# Altium project Ticket_Dispancer.PrjPcb (part 2 of 3)

## Sheet LAN.SchDoc
size A4; SheetNumber: 4; SheetTotal: 8
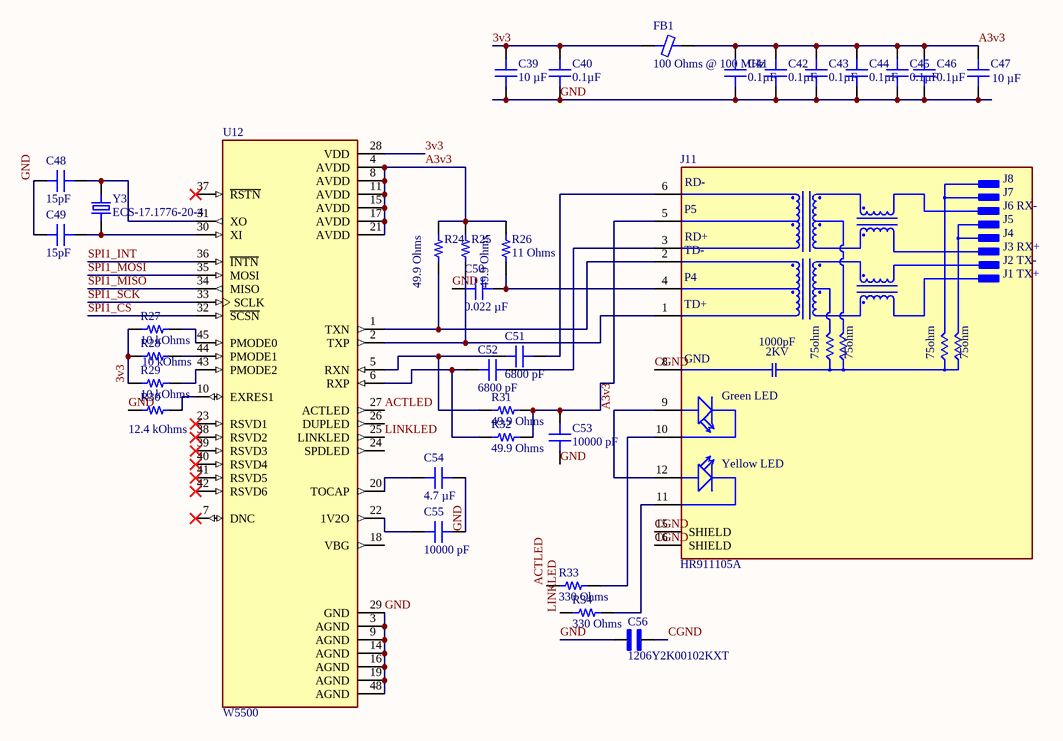
[diagram p3: LAN.SchDoc]

### Parts
C39  10 µF  [CAP 1206_3216 - 0.8MM]
C40  Capacitance: 0.1µF  [CAP 0805_2012]  (hidden comment: 1µF)
C41  Capacitance: 0.1µF  [CAP 0805_2012]  (hidden comment: 1µF)
C42  Capacitance: 0.1µF  [CAP 0805_2012]  (hidden comment: 1µF)
C43  Capacitance: 0.1µF  [CAP 0805_2012]  (hidden comment: 1µF)
C44  Capacitance: 0.1µF  [CAP 0805_2012]  (hidden comment: 1µF)
C45  Capacitance: 0.1µF  [CAP 0805_2012]  (hidden comment: 1µF)
C46  Capacitance: 0.1µF  [CAP 0805_2012]  (hidden comment: 1µF)
C47  10 µF  [CAP 1206_3216 - 0.8MM]
C48  15pF  [CAP 0805_2012]
C49  15pF  [CAP 0805_2012]
C50  0.022 µF  [CAP 0805_2012]
C51  6800 pF  [CAP 0805_2012]
C52  6800 pF  [CAP 0805_2012]
C53  10000 pF  [CAP 0805_2012]
C54  4.7 µF  [CAP 0805_2012]
C55  10000 pF  [CAP 0805_2012]
C56  1206Y2K00102KXT  [CAPC3216X160N]
FB1  100 Ohms @ 100 MHz  [FER 0805_2012]
J11  HR911105A  [HANRUN_HR911105A]
R24  49.9 Ohms  [RES 0805_2012]
R25  49.9 Ohms  [RES 0805_2012]
R26  11 Ohms  [RES 0805_2012]
R27  10 kOhms  [RES 0805_2012]
R28  10 kOhms  [RES 0805_2012]
R29  10 kOhms  [RES 0805_2012]
R30  12.4 kOhms  [RES 0805_2012]
R31  49.9 Ohms  [RES 0805_2012]
R32  49.9 Ohms  [RES 0805_2012]
R33  330 Ohms  [YAGEO RES 0805_2012]
R34  330 Ohms  [YAGEO RES 0805_2012]
U12  W5500  [QFP50P900X900X160-48N]
Y3  ECS-17.1776-20-4  [XTAL_ECS-160-20-4X]

### Nets
3v3: C39.2 C40.2 FB1.1 R27.1 R28.1 R29.1 U12.28(VDD)
A3v3: C41.2 C42.2 C43.2 C44.2 C45.2 C46.2 C47.2 FB1.2 J11.9(GA) J11.12(YA) R24.2 R25.2 R26.2 U12.4(AVDD) U12.8(AVDD) U12.11(AVDD) U12.15(AVDD) U12.17(AVDD) U12.21(AVDD)
ACTLED: R33.1 U12.27(ACTLED)
CGND: C56.2 J11.8(GND) J11.15(SHIELD) J11.16(SHIELD)
GND: C39.1 C40.1 C41.1 C42.1 C43.1 C44.1 C45.1 C46.1 C47.1 C48.1 C49.1 C50.2 C53.1 C54.2 C55.2 C56.1 R30.1 U12.3(AGND) U12.9(AGND) U12.14(AGND) U12.16(AGND) U12.19(AGND) U12.29(GND) U12.48(AGND)
LINKLED: R34.1 U12.25(LINKLED)
SPI1_CS: U12.32(~{SCSN})
SPI1_INT: U12.36(~{INTN})
SPI1_MISO: U12.34(MISO)
SPI1_MOSI: U12.35(MOSI)
SPI1_SCK: U12.33(SCLK)
NetC48_2: C48.2 U12.31(XO) Y3.2
NetC49_2: C49.2 U12.30(XI) Y3.1
NetC50_1: C50.1 J11.4(P4) R26.1
NetC51_1: C51.1 R31.2 U12.5(RXN)
NetC51_2: C51.2 J11.6(RD-)
NetC52_1: C52.1 R32.2 U12.6(RXP)
NetC52_2: C52.2 J11.3(RD+)
NetC53_2: C53.2 J11.5(P5) R31.1 R32.1
NetC54_1: C54.1 U12.20(TOCAP)
NetC55_1: C55.1 U12.22(1V2O)
NetJ11_1: J11.1(TD+) R25.1 U12.2(TXP)
NetJ11_2: J11.2(TD-) R24.1 U12.1(TXN)
NetJ11_10: J11.10(GC) R33.2
NetJ11_11: J11.11(YC) R34.2
NetR27_2: R27.2 U12.45(PMODE0)
NetR28_2: R28.2 U12.44(PMODE1)
NetR29_2: R29.2 U12.43(PMODE2)
NetR30_2: R30.2 U12.10(EXRES1)

Not connected (* = marked no-connect by the designer): U12 7(DNC)* 18(VBG) 23(RSVD1)* 24(SPDLED) 26(DUPLED) 37(~{RSTN})* 38(RSVD2)* 39(RSVD3)* 40(RSVD4)* 41(RSVD5)* 42(RSVD6)*

### Notes on the sheet
- (in symbol HR911105A) J8; J7; J6 RX-; J5; J4; J3 RX+; J2 TX-; J1 TX+; 1000pF; 2KV; 75ohm; Green LED; Yellow LED

### Library data of the parts
C39 C47 = EMK316BJ106MD-T: CAP CER 10UF 16V X5R 1206; manufacturer: Taiyo Yuden; Tolerance: ±20%; Part Number: EMK316BJ106MD-T; Capacitance: 10 µF; Applications: SMPS Filtering; componentlink1description: Datasheet; componentlink1url: http://www.yuden.co.jp/productdata/catalog/mlcc06_e.pdf; componentlink2description: DigiKey Link; componentlink2url: https://www.digikey.com/en/products/detail/taiyo-yuden/EMK316BJ106MD-T/6563474; Device Package: 1206 (3216 Metric); lastupdated: 04-06-2024 7.10.41 PM; Lifecycle Status: Active; Minimum Order: 1; Mounting Type: Surface Mount, MLCC; Operating Temperature: -55°C ~ 85°C; Package / Case: 1206 (3216 Metric); packaging: TapeAndReel; partid: 18996; Part Status: Active; price: 0.04; series: M; Size / Dimension: 0.126" L x 0.063" W (3.20mm x 1.60mm); Supplier 1: DigiKey; Supplier Part Number 1: 587-4881-1-ND; Temperature Coefficient: X5R; Thickness (Max): 0.037" (0.95mm); value: 10 µF; Voltage - Rated: 16V
C40-C46 = 0805ZC105KAT4A: CAP CER 1UF 10V X7R 0805; manufacturer: AVX Corporation; Tolerance: ±10%; Part Number: 0805ZC105KAT4A; Applications: General Purpose; componentlink1description: Datasheet; componentlink1url: http://datasheets.avx.com/X7RDielectric.pdf; componentlink2description: DigiKey Link; componentlink2url: http://digikey.com/product-detail/en/avx-corporation/0805ZC105KAT4A/478-7604-1-ND/7536237; Device Package: 0805 (2012 Metric); lastupdated: 02-09-2020 1.04.40 AM; Lifecycle Status: Active; Minimum Order: 1; Mounting Type: Surface Mount, MLCC; Operating Temperature: -55°C ~ 125°C; Package / Case: 0805 (2012 Metric); packaging: TapeAndReel; partid: 3500; Part Status: Active; price: 0.17; series: -; Size / Dimension: 0.079" L x 0.049" W (2.00mm x 1.25mm); Supplier 1: DigiKey; Supplier Part Number 1: 478-7604-1-ND; Temperature Coefficient: X7R; Thickness (Max): 0.037" (0.94mm); value: 1µF; Voltage - Rated: 10V
C48 C49 = 08055A150JAT2A: CAP CER 15PF 50V C0G/NP0 0805; manufacturer: AVX Corporation; Temperature Coefficient: C0G, NP0; Tolerance: ±5%; Part Number: 08055A150JAT2A; Capacitance: 15pF; Applications: General Purpose; componentlink1description: Datasheet; componentlink1url: http://datasheets.avx.com/C0GNP0-Dielectric.pdf; componentlink2description: DigiKey Link; componentlink2url: http://digikey.com/product-detail/en/avx-corporation/08055A150JAT2A/478-1306-1-ND/564338; Device Package: 0805 (2012 Metric); lastupdated: 02-09-2020 1.04.40 AM; Lifecycle Status: Active; Minimum Order: 1; Mounting Type: Surface Mount, MLCC; Operating Temperature: -55°C ~ 125°C; Package / Case: 0805 (2012 Metric); packaging: TapeAndReel; partid: 3213; Part Status: Active; price: 0.02; series: -; Size / Dimension: 0.079" L x 0.049" W (2.01mm x 1.25mm); Supplier 1: DigiKey; Supplier Part Number 1: 478-1306-1-ND; Thickness (Max): 0.037" (0.94mm); value: 15pF; Voltage - Rated: 50V
C50 = C0805C223K5RECAUTO: CAP CER 0805 22NF 50V X7R 10%; manufacturer: KEMET; Part Number: C0805C223K5RECAUTO; Capacitance: 0.022 µF; Applications: Automotive, ESD Protection; componentlink1description: Datasheet; componentlink1url: https://api.kemet.com/component-edge/download/datasheet/C0805C223K5RECAUTO.pdf; componentlink2description: DigiKey Link; componentlink2url: https://www.digikey.com/en/products/detail/kemet/C0805C223K5RECAUTO/8640480; Device Package: 0805 (2012 Metric); lastupdated: 09-02-2024 8.15.30 PM; Lifecycle Status: Active; Minimum Order: 1; Mounting Type: Surface Mount, MLCC; Operating Temperature: -55°C ~ 125°C; Package / Case: 0805 (2012 Metric); packaging: TapeAndReel; partid: 15719; Part Status: Active; price: 0.04; Ratings: AEC-Q200; series: ESD SMD Auto X7R; Size / Dimension: 0.079" L x 0.049" W (2.00mm x 1.25mm); Supplier 1: DigiKey; Supplier Part Number 1: 399-17886-1-ND; Temperature Coefficient: X7R; Thickness (Max): 0.035" (0.88mm); Tolerance: ±10%; value: 0.022 µF; Voltage - Rated: 50V
C51 C52 = C0805C682M3GEC7800: CAP CER 0805 6.8NF 25V C0G 20%; manufacturer: KEMET; Temperature Coefficient: C0G, NP0; Part Number: C0805C682M3GEC7800; Capacitance: 6800 pF; Applications: ESD Protection; componentlink1description: Datasheet; componentlink1url: https://connect.kemet.com:7667/gateway/IntelliData-ComponentDocumentation/1.0/download/datasheet/C0805C682M3GEC7800; componentlink2description: DigiKey Link; componentlink2url: https://www.digikey.com/en/products/detail/kemet/C0805C682M3GEC7800/8644610; Device Package: 0805 (2012 Metric); Features: Low ESL; lastupdated: 09-02-2024 8.14.56 PM; Lifecycle Status: Active; Minimum Order: 1; Mounting Type: Surface Mount, MLCC; Operating Temperature: -55°C ~ 125°C; Package / Case: 0805 (2012 Metric); packaging: TapeAndReel; partid: 46454; Part Status: Active; price: 0.06; series: ESD SMD Comm C0G; Size / Dimension: 0.079" L x 0.049" W (2.00mm x 1.25mm); Supplier 1: DigiKey; Supplier Part Number 1: 399-C0805C682M3GEC7800CT-ND; Thickness (Max): 0.055" (1.40mm); Tolerance: ±20%; value: 6800 pF; Voltage - Rated: 25V
C53 C55 = C0805X103K1RAC3316: CAP CER 0805 10NF 100V X7R; manufacturer: KEMET; Tolerance: ±10%; Part Number: C0805X103K1RAC3316; Capacitance: 10000 pF; Applications: Automotive, Boardflex Sensitive; componentlink1description: Datasheet; componentlink1url: https://api.kemet.com/component-edge/download/datasheet/C0805X103K1RAC3316.pdf; componentlink2description: DigiKey Link; componentlink2url: https://www.digikey.com/en/products/detail/kemet/C0805X103K1RAC3316/10315780; Device Package: 0805 (2012 Metric); Features: Soft Termination; lastupdated: 09-02-2024 8.16.09 PM; Lifecycle Status: Active; Minimum Order: 1; Mounting Type: Surface Mount, MLCC; Operating Temperature: -55°C ~ 125°C; Package / Case: 0805 (2012 Metric); packaging: TapeAndReel; partid: 2565; Part Status: Active; price: 0.02; Ratings: AEC-Q200; series: SMD Auto X7R VW80808; Size / Dimension: 0.079" L x 0.049" W (2.00mm x 1.25mm); Supplier 1: DigiKey; Supplier Part Number 1: 399-C0805X103K1RAC3316CT-ND; Temperature Coefficient: X7R; Thickness (Max): 0.039" (0.98mm); value: 10000 pF; Voltage - Rated: 100V
C54 = C0805X475M3RAC7800: 4.70UF 25.0V; manufacturer: KEMET; Temperature Coefficient: X7R; Tolerance: ±20%; Voltage - Rated: 25V; Part Number: C0805X475M3RAC7800; Capacitance: 4.7 µF; Applications: Boardflex Sensitive; componentlink1description: Datasheet; componentlink1url: https://connect.kemet.com:7667/gateway/IntelliData-ComponentDocumentation/1.0/download/datasheet/C0805X475M3RAC7800; componentlink2description: DigiKey Link; componentlink2url: https://www.digikey.com/en/products/detail/kemet/C0805X475M3RAC7800/12082671; Device Package: 0805 (2012 Metric); Features: Soft Termination; lastupdated: 09-02-2024 8.14.56 PM; Lifecycle Status: Active; Minimum Order: 1; Mounting Type: Surface Mount, MLCC; Operating Temperature: -55°C ~ 125°C; Package / Case: 0805 (2012 Metric); packaging: TapeAndReel; partid: 46494; Part Status: Active; price: 0.14; series: SMD Comm X7R Flex; Size / Dimension: 0.079" L x 0.049" W (2.00mm x 1.25mm); Supplier 1: DigiKey; Supplier Part Number 1: 399-C0805X475M3RAC7800CT-ND; Thickness (Max): 0.057" (1.45mm); value: 4.7 µF
C56 = 1206Y2K00102KXT: 1000 pF Â±10% 2000V (2kV) Ceramic Capacitor X7R 1206 (3216 Metric); MF: Knowles Syfer; SnapEDA_Link: https://www.snapeda.com/parts/1206Y2K00102KXT/Knowles+Syfer/view-part/?ref=snap; Package: 3216 Knowles Syfer; Value: *; MP: 1206Y2K00102KXT; Check_prices: https://www.snapeda.com/parts/1206Y2K00102KXT/Knowles+Syfer/view-part/?ref=eda
FB1 = HRB0805S101K1.00FT: FERRITE BEAD, CHIP, 0805, 100 OH; Manufacturer: AEM, Inc.; Current Rating (Max): 1A; DC Resistance (DCR) (Max): 200mOhm; Number of Lines: 1; Part Number: HRB0805S101K1.00FT; ComponentLink2Description: DigiKey Link; ComponentLink2URL: https://www.digikey.com/en/products/detail/aem-inc/HRB0805S101K1-00FT/23025488; Device Package: 0805 (2012 Metric); Height (Max): 0.043" (1.10mm); Impedance @ Frequency: 100 Ohms @ 100 MHz; LastUpdated: 29-03-2026 8.09.51 PM; Lifecycle Status: Active; Minimum Order: 1; Mounting Type: Surface Mount; Operating Temperature: -55°C ~ 125°C; Package / Case: 0805 (2012 Metric); Packaging: TapeAndReel; PartId: 4402; Price: 158.37; Series: HRB; Size / Dimension: 0.079" L x 0.049" W (2.00mm x 1.25mm); Supplier 1: DigiKey; Supplier Part Number 1: 5433-HRB0805S101K1.00FTCT-ND; Value: 100 Ohms @ 100 MHz
J11 = HR911105A: DIP RJ45 Connector;; MF: hanrun; SnapEDA_Link: https://www.snapeda.com/parts/HR911105A/HanRun/view-part/?ref=snap; Package: None; MP: HR911105A; Check_prices: https://www.snapeda.com/parts/HR911105A/HanRun/view-part/?ref=eda; Price: None; Value: *; Availability: Not in stock
R24 R25 R31 R32 = RCC080549R9FKEA: RCC0805 100 49R9 1% ET1 E3; Manufacturer: Vishay Dale; Power (Watts): 0.25W, 1/4W; Temperature Coefficient: ±100ppm/°C; Part Number: RCC080549R9FKEA; Value: 49.9 Ohms; ComponentLink1Description: Datasheet; ComponentLink1URL: https://www.vishay.com/docs/20066/rcce3.pdf; ComponentLink2Description: DigiKey Link; ComponentLink2URL: https://www.digikey.com/en/products/detail/vishay-dale/RCC080549R9FKEA/12084236; Composition: Thick Film; Device Package: 0805 (2012 Metric); Features: Automotive AEC-Q200; Height - Seated (Max): 0.020" (0.50mm); LastUpdated: 08-02-2024 9.00.29 PM; Lifecycle Status: Active; Minimum Order: 1; Number of Terminations: 2; Operating Temperature: -55°C ~ 155°C; Package / Case: 0805 (2012 Metric); Packaging: TapeAndReel; PartId: 60620; Part Status: Active; Price: 0.02; Ratings: AEC-Q200; Resistance: 49.9 Ohms; Series: RCC e3; Size / Dimension: 0.079" L x 0.049" W (2.00mm x 1.25mm); Supplier 1: DigiKey; Supplier Part Number 1: 541-RCC080549R9FKEACT-ND; Supplier Device Package: 0805; Tolerance: ±1%
R26 = KTR10EZPF11R0: RES SMD 11 OHM 1% 1/8W 0805; Manufacturer: Rohm Semiconductor; Power (Watts): 0.125W, 1/8W; Temperature Coefficient: ±100ppm/°C; Part Number: KTR10EZPF11R0; Value: 11 Ohms; ComponentLink1Description: Datasheet; ComponentLink1URL: https://www.rohm.com/datasheet/KTR03EZPF/ktr-e; ComponentLink2Description: DigiKey Link; ComponentLink2URL: https://www.digikey.com/en/products/detail/rohm-semiconductor/KTR10EZPF11R0/4051740; Composition: Thick Film; Device Package: 0805 (2012 Metric); Features: Automotive AEC-Q200, High Voltage; Height - Seated (Max): 0.026" (0.65mm); LastUpdated: 08-02-2024 9.01.51 PM; Lifecycle Status: Active; Minimum Order: 1; Number of Terminations: 2; Operating Temperature: -55°C ~ 155°C; Package / Case: 0805 (2012 Metric); Packaging: TapeAndReel; PartId: 39009; Part Status: Active; Price: 0.02; Ratings: AEC-Q200; Resistance: 11 Ohms; Series: KTR; Size / Dimension: 0.079" L x 0.049" W (2.00mm x 1.25mm); Supplier 1: DigiKey; Supplier Part Number 1: RHM11AHCT-ND; Supplier Device Package: 0805; Tolerance: ±1%
R27-R29 = RNCS0805BKE10K0: RES 10K OHM 0.1% 1/10W 0805; Manufacturer: Stackpole Electronics Inc; Power (Watts): 0.1W, 1/10W; Temperature Coefficient: ±25ppm/°C; Part Number: RNCS0805BKE10K0; Value: 10 kOhms; ComponentLink1Description: Datasheet; ComponentLink1URL: https://www.seielect.com/catalog/sei-rncs_rnch.pdf; ComponentLink2Description: DigiKey Link; ComponentLink2URL: https://www.digikey.com/en/products/detail/stackpole-electronics-inc/RNCS0805BKE10K0/1800067; Composition: Thin Film; Device Package: 0805 (2012 Metric); Features: Anti-Corrosive, Automotive AEC-Q200, Moisture Resistant; Height - Seated (Max): 0.026" (0.65mm); LastUpdated: 08-02-2024 9.02.39 PM; Lifecycle Status: Active; Minimum Order: 1; Number of Terminations: 2; Operating Temperature: -55°C ~ 155°C; Package / Case: 0805 (2012 Metric); Packaging: TapeAndReel; PartId: 27713; Part Status: Active; Price: 0.07; Ratings: AEC-Q200; Resistance: 10 kOhms; Series: RNCS; Size / Dimension: 0.079" L x 0.049" W (2.00mm x 1.25mm); Supplier 1: DigiKey; Supplier Part Number 1: RNCS0805BKE10K0CT-ND; Supplier Device Package: 0805; Tolerance: ±0.1%
R30 = RQ73C2A12K4BTD: RES 12.4 KOHMS 0.1% 1/5W 0805; Manufacturer: TE Connectivity Passive Product; Power (Watts): 0.2W, 1/5W; Temperature Coefficient: ±10ppm/°C; Part Number: RQ73C2A12K4BTD; Value: 12.4 kOhms; ComponentLink1Description: Datasheet; ComponentLink1URL: //media.digikey.com/pdf/Data%20Sheets/Tyco%20Electronics%20P%20B%20PDFs/RQ73-0618%20v2.pdf; ComponentLink2Description: DigiKey Link; ComponentLink2URL: https://www.digikey.com/en/products/detail/te-connectivity-passive-product/RQ73C2A12K4BTD/9479810; Composition: Thin Film; Device Package: 0805 (2012 Metric); Features: Anti-Sulfur, Automotive AEC-Q200; Height - Seated (Max): 0.026" (0.65mm); LastUpdated: 08-02-2024 9.02.26 PM; Lifecycle Status: Active; Minimum Order: 1; Number of Terminations: 2; Operating Temperature: -55°C ~ 155°C; Package / Case: 0805 (2012 Metric); Packaging: TapeAndReel; PartId: 30590; Part Status: Active; Price: 0.24; Ratings: AEC-Q200; Resistance: 12.4 kOhms; Series: RQ73; Size / Dimension: 0.079" L x 0.049" W (2.00mm x 1.25mm); Supplier 1: DigiKey; Supplier Part Number 1: A139862CT-ND; Supplier Device Package: 0805; Tolerance: ±0.1%
R33 R34 = RC0805FR-07330RL: RES 330 OHM 1% 1/8W 0805; Manufacturer: Yageo; Power (Watts): 0.125W, 1/8W; Temperature Coefficient: ±100ppm/°C; Part Number: RC0805FR-07330RL; Value: 330 Ohms; ComponentLink1Description: Datasheet; ComponentLink1URL: https://www.yageo.com/upload/media/product/productsearch/datasheet/rchip/PYu-RC_Group_51_RoHS_L_10.pdf; ComponentLink2Description: DigiKey Link; ComponentLink2URL: https://www.digikey.com/en/products/detail/yageo/RC0805FR-07330RL/727866; Composition: Thick Film; Device Package: 0805 (2012 Metric); Features: Moisture Resistant; Height - Seated (Max): 0.024" (0.60mm); LastUpdated: 25-07-2024 9.20.25 AM; Lifecycle Status: Active; Minimum Order: 1; Number of Terminations: 2; Operating Temperature: -55°C ~ 155°C; Package / Case: 0805 (2012 Metric); Packaging: TapeAndReel; PartId: 32600; Part Status: Active; Price: 0.01; Resistance: 330 Ohms; Series: RC_L; Size / Dimension: 0.079" L x 0.049" W (2.00mm x 1.25mm); Supplier 1: DigiKey; Supplier Part Number 1: 311-330CRCT-ND; Supplier Device Package: 0805; Tolerance: ±1%
U12 = W5500: Hardwired TCP/IP embedded Ethernet controller; Availability: Unavailable; MP: W5500; Value: *; Price: None; Package: None
Y3 = ECS-17.1776-20-4: Crystals 17.1776MHz HC49S; MF: ECS International; SnapEDA_Link: https://www.snapeda.com/parts/ECS-17.1776-20-4/ECS/view-part/?ref=snap; Package: HC-49US ECS Inc.; Value: *; MP: ECS-17.1776-20-4; Check_prices: https://www.snapeda.com/parts/ECS-17.1776-20-4/ECS/view-part/?ref=eda

## Sheet DI_DO.SchDoc
size A4; SheetNumber: 5; SheetTotal: 8
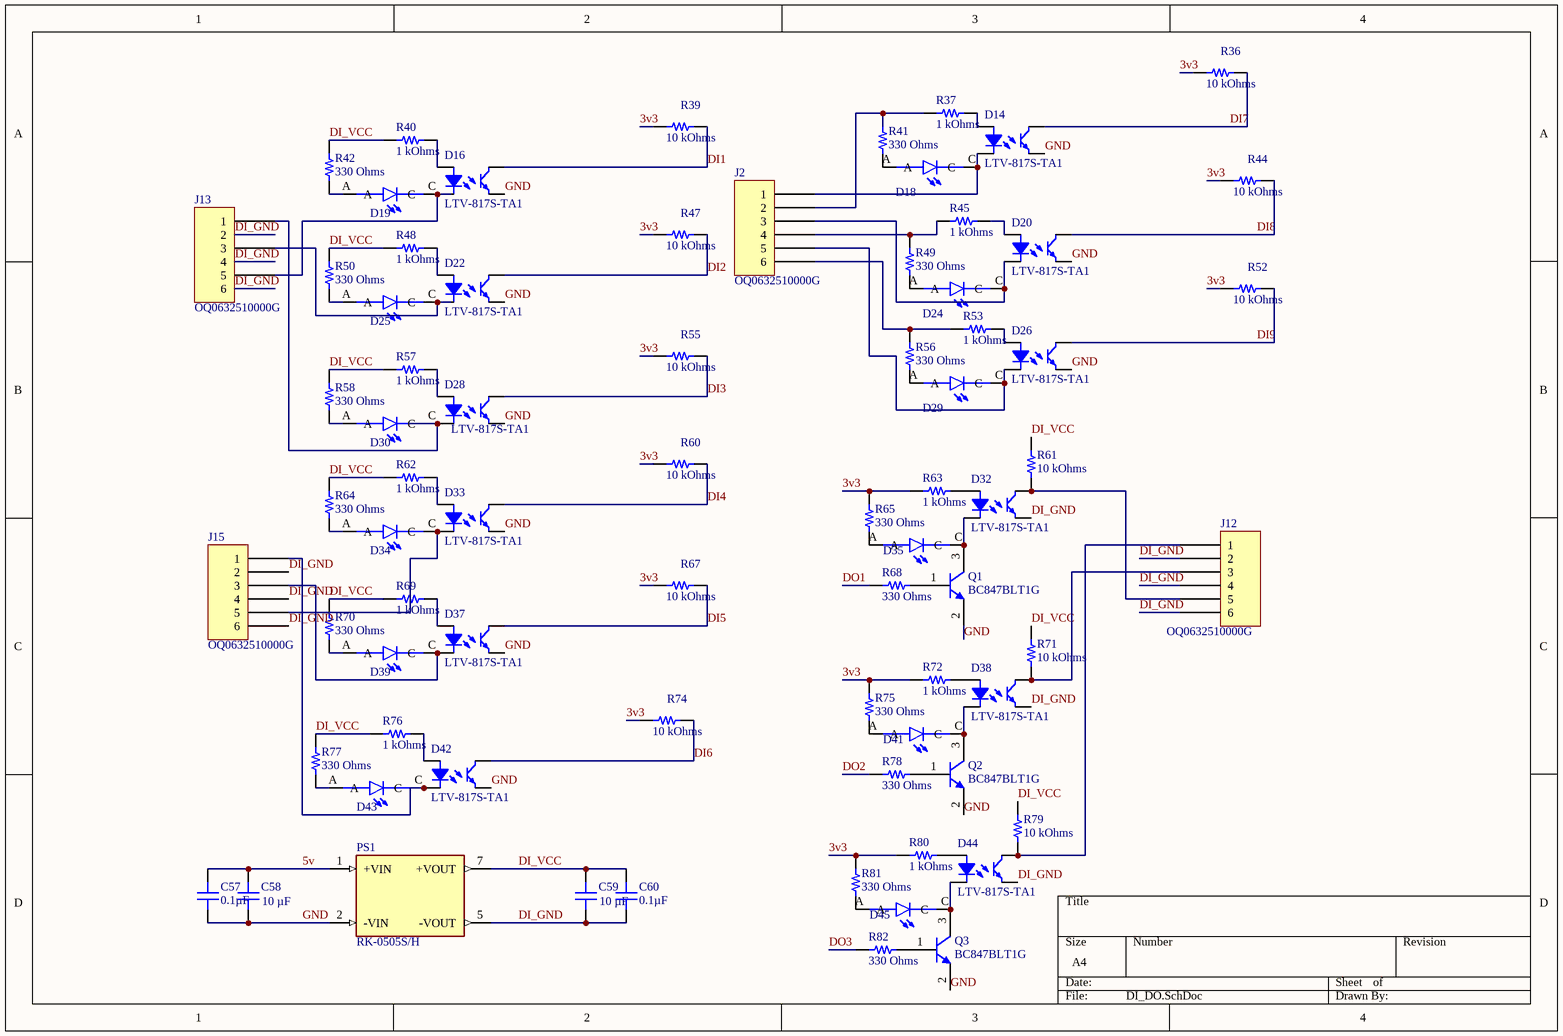
[diagram p4: DI_DO.SchDoc]

### Parts
C57  Capacitance: 0.1µF  [CAP 0805_2012]  (hidden comment: 1µF)
C58  10 µF  [CAP 1206_3216 - 0.8MM]
C59  10 µF  [CAP 1206_3216 - 0.8MM]
C60  Capacitance: 0.1µF  [CAP 0805_2012]  (hidden comment: 1µF)
D14  LTV-817S-TA1  [LITEON LTV-817]
D16  LTV-817S-TA1  [LITEON LTV-817]
D18  597-3305-607F  [LEDC2012X70N]  (value not drawn)
D19  597-3305-607F  [LEDC2012X70N]  (value not drawn)
D20  LTV-817S-TA1  [LITEON LTV-817]
D22  LTV-817S-TA1  [LITEON LTV-817]
D24  597-3305-607F  [LEDC2012X70N]  (value not drawn)
D25  597-3305-607F  [LEDC2012X70N]  (value not drawn)
D26  LTV-817S-TA1  [LITEON LTV-817]
D28  LTV-817S-TA1  [LITEON LTV-817]
D29  597-3305-607F  [LEDC2012X70N]  (value not drawn)
D30  597-3305-607F  [LEDC2012X70N]  (value not drawn)
D32  LTV-817S-TA1  [LITEON LTV-817]
D33  LTV-817S-TA1  [LITEON LTV-817]
D34  597-3305-607F  [LEDC2012X70N]  (value not drawn)
D35  597-3305-607F  [LEDC2012X70N]  (value not drawn)
D37  LTV-817S-TA1  [LITEON LTV-817]
D38  LTV-817S-TA1  [LITEON LTV-817]
D39  597-3305-607F  [LEDC2012X70N]  (value not drawn)
D41  597-3305-607F  [LEDC2012X70N]  (value not drawn)
D42  LTV-817S-TA1  [LITEON LTV-817]
D43  597-3305-607F  [LEDC2012X70N]  (value not drawn)
D44  LTV-817S-TA1  [LITEON LTV-817]
D45  597-3305-607F  [LEDC2012X70N]  (value not drawn)
J2  OQ0632510000G  [FCI 06-381-6PIN]
J12  OQ0632510000G  [FCI 06-381-6PIN]
J13  OQ0632510000G  [FCI 06-381-6PIN]
J15  OQ0632510000G  [FCI 06-381-6PIN]
PS1  RK-0505S/H  [CONV_RK-0505S/H]
Q1  BC847BLT1G  [ON SEMI SOT-23-3]
Q2  BC847BLT1G  [ON SEMI SOT-23-3]
Q3  BC847BLT1G  [ON SEMI SOT-23-3]
R36  10 kOhms  [RES 0805_2012]
R37  1 kOhms  [RES 0805_2012]
R39  10 kOhms  [RES 0805_2012]
R40  1 kOhms  [RES 0805_2012]
R41  330 Ohms  [RES 0805_2012]
R42  330 Ohms  [RES 0805_2012]
R44  10 kOhms  [RES 0805_2012]
R45  1 kOhms  [RES 0805_2012]
R47  10 kOhms  [RES 0805_2012]
R48  1 kOhms  [RES 0805_2012]
R49  330 Ohms  [RES 0805_2012]
R50  330 Ohms  [RES 0805_2012]
R52  10 kOhms  [RES 0805_2012]
R53  1 kOhms  [RES 0805_2012]
R55  10 kOhms  [RES 0805_2012]
R56  330 Ohms  [RES 0805_2012]
R57  1 kOhms  [RES 0805_2012]
R58  330 Ohms  [RES 0805_2012]
R60  10 kOhms  [RES 0805_2012]
R61  10 kOhms  [RES 0805_2012]
R62  1 kOhms  [RES 0805_2012]
R63  1 kOhms  [RES 0805_2012]
R64  330 Ohms  [RES 0805_2012]
R65  330 Ohms  [RES 0805_2012]
R67  10 kOhms  [RES 0805_2012]
R68  330 Ohms  [RES 0805_2012]
R69  1 kOhms  [RES 0805_2012]
R70  330 Ohms  [RES 0805_2012]
R71  10 kOhms  [RES 0805_2012]
R72  1 kOhms  [RES 0805_2012]
R74  10 kOhms  [RES 0805_2012]
R75  330 Ohms  [RES 0805_2012]
R76  1 kOhms  [RES 0805_2012]
R77  330 Ohms  [RES 0805_2012]
R78  330 Ohms  [RES 0805_2012]
R79  10 kOhms  [RES 0805_2012]
R80  1 kOhms  [RES 0805_2012]
R81  330 Ohms  [RES 0805_2012]
R82  330 Ohms  [RES 0805_2012]

### Nets
3v3: R36.2 R39.2 R44.2 R47.2 R52.2 R55.2 R60.2 R63.1 R65.1 R67.2 R72.1 R74.2 R75.1 R80.1 R81.1
5v: C57.2 C58.2 PS1.1(+VIN)
DI1: D16.4 R39.1
DI2: D22.4 R47.1
DI3: D28.4 R55.1
DI4: D33.4 R60.1
DI5: D37.4 R67.1
DI6: D42.4 R74.1
DI7: D14.4 R36.1
DI8: D20.4 R44.1
DI9: D26.4 R52.1
DI_GND: C59.1 C60.1 D32.3 D38.3 D44.3 J12.2 J12.4 J12.6 J13.2 J13.4 J13.6 J15.2 J15.4 J15.6 PS1.5(-VOUT)
DI_VCC: C59.2 C60.2 PS1.7(+VOUT) R40.1 R42.2 R48.1 R50.2 R57.1 R58.2 R61.1 R62.1 R64.2 R69.1 R70.2 R71.1 R76.1 R77.2 R79.1
DO1: R68.1
DO2: R78.1
DO3: R82.1
GND: C57.1 C58.1 D14.3 D16.3 D20.3 D22.3 D26.3 D28.3 D33.3 D37.3 D42.3 PS1.2(-VIN) Q1.2(E) Q2.2(E) Q3.2(E)
NetD14_1: D14.1 R37.2
NetD14_2: D14.2 D18.C J2.1
NetD16_1: D16.1 R40.2
NetD16_2: D16.2 D19.C J13.5
NetD18_A: D18.A R41.2
NetD19_A: D19.A R42.1
NetD20_1: D20.1 R45.2
NetD20_2: D20.2 D24.C J2.3
NetD22_1: D22.1 R48.2
NetD22_2: D22.2 D25.C J13.3
NetD24_A: D24.A R49.2
NetD25_A: D25.A R50.1
NetD26_1: D26.1 R53.2
NetD26_2: D26.2 D29.C J2.5
NetD28_1: D28.1 R57.2
NetD28_2: D28.2 D30.C J13.1
NetD29_A: D29.A R56.2
NetD30_A: D30.A R58.1
NetD32_1: D32.1 R63.2
NetD32_2: D32.2 D35.C Q1.3(C)
NetD32_4: D32.4 J12.5 R61.2
NetD33_1: D33.1 R62.2
NetD33_2: D33.2 D34.C J15.5
NetD34_A: D34.A R64.1
NetD35_A: D35.A R65.2
NetD37_1: D37.1 R69.2
NetD37_2: D37.2 D39.C J15.3
NetD38_1: D38.1 R72.2
NetD38_2: D38.2 D41.C Q2.3(C)
NetD38_4: D38.4 J12.3 R71.2
NetD39_A: D39.A R70.1
NetD41_A: D41.A R75.2
NetD42_1: D42.1 R76.2
NetD42_2: D42.2 D43.C J15.1
NetD43_A: D43.A R77.1
NetD44_1: D44.1 R80.2
NetD44_2: D44.2 D45.C Q3.3(C)
NetD44_4: D44.4 J12.1 R79.2
NetD45_A: D45.A R81.2
NetJ2_2: J2.2 R37.1 R41.1
NetJ2_4: J2.4 R45.1 R49.1
NetJ2_6: J2.6 R53.1 R56.1
NetQ1_1: Q1.1(B) R68.2
NetQ2_1: Q2.1(B) R78.2
NetQ3_1: Q3.1(B) R82.2

### Library data of the parts
C57 C60 = 0805ZC105KAT4A: as C40 on sheet LAN; Part Number: 0805ZC105KAT4A; Applications: General Purpose; componentlink1description: Datasheet; componentlink1url: http://datasheets.avx.com/X7RDielectric.pdf; componentlink2description: DigiKey Link; componentlink2url: http://digikey.com/product-detail/en/avx-corporation/0805ZC105KAT4A/478-7604-1-ND/7536237; Device Package: 0805 (2012 Metric); lastupdated: 02-09-2020 1.04.40 AM; Lifecycle Status: Active; Minimum Order: 1; Mounting Type: Surface Mount, MLCC; Operating Temperature: -55°C ~ 125°C; Package / Case: 0805 (2012 Metric); packaging: TapeAndReel; partid: 3500; Part Status: Active; price: 0.17; series: -; Size / Dimension: 0.079" L x 0.049" W (2.00mm x 1.25mm); Supplier 1: DigiKey; Supplier Part Number 1: 478-7604-1-ND; Temperature Coefficient: X7R; Thickness (Max): 0.037" (0.94mm); value: 1µF; Voltage - Rated: 10V
C58 C59 = EMK316BJ106MD-T: as C39 on sheet LAN; Part Number: EMK316BJ106MD-T; Capacitance: 10 µF; Applications: SMPS Filtering; componentlink1description: Datasheet; componentlink1url: http://www.yuden.co.jp/productdata/catalog/mlcc06_e.pdf; componentlink2description: DigiKey Link; componentlink2url: https://www.digikey.com/en/products/detail/taiyo-yuden/EMK316BJ106MD-T/6563474; Device Package: 1206 (3216 Metric); lastupdated: 04-06-2024 7.10.41 PM; Lifecycle Status: Active; Minimum Order: 1; Mounting Type: Surface Mount, MLCC; Operating Temperature: -55°C ~ 85°C; Package / Case: 1206 (3216 Metric); packaging: TapeAndReel; partid: 18996; Part Status: Active; price: 0.04; series: M; Size / Dimension: 0.126" L x 0.063" W (3.20mm x 1.60mm); Supplier 1: DigiKey; Supplier Part Number 1: 587-4881-1-ND; Temperature Coefficient: X5R; Thickness (Max): 0.037" (0.95mm); value: 10 µF; Voltage - Rated: 16V
D14 D16 D20 D22 D26 D28 D32 D33 D37 D38 D42 D44 = LTV-817S-TA1: OPTOISOLATR 5KV TRANSISTOR 4-SMD; Manufacturer: Lite-On Inc.; Current - DC Forward (If) (Max): 50mA; Current Transfer Ratio (Max): 600% @ 5mA; Current Transfer Ratio (Min): 50% @ 5mA; Input Type: DC; Number of Channels: 1; Rise / Fall Time (Typ): 4µs, 3µs; Vce Saturation (Max): 200mV; Voltage - Forward (Vf) (Typ): 1.2V; Voltage - Isolation: 5000Vrms; Voltage - Output (Max): 35V; Part Number: LTV-817S-TA1; ComponentLink1Description: Datasheet; ComponentLink1URL: http://optoelectronics.liteon.com/upload/download/DS-70-96-0016/LTV-8X7%20series%20201610%20.pdf; ComponentLink2Description: DigiKey Link; ComponentLink2URL: http://digikey.com/product-detail/en/lite-on-inc/LTV-817S-TA1/160-1893-1-ND/3306757; Current - Output / Channel: 50mA; Device Package: 4-SMD, Gull Wing; LastUpdated: 12-01-2020 9.58.48 PM; Lifecycle Status: Active; Minimum Order: 1; Mounting Type: Surface Mount; Operating Temperature: -30°C ~ 110°C; Output Type: Transistor; Package / Case: 4-SMD, Gull Wing; Packaging: TapeAndReel; Part Status: Active; Price: 0.12; Series: -; Supplier 1: DigiKey; Supplier Part Number 1: 160-1893-1-ND; Supplier Device Package: 4-SMD
D18 D19 D24 D25 D29 D30 D34 D35 D39 D41 D43 D45 = 597-3305-607F: LED Uni-Color Green 4-Pin Chip 0805 T/R; Availability: Unavailable; Value: *; Price: None; MP: 597-3305-607F; Package: None
J2 J12 J13 J15 = OQ0632510000G: TERM BLOCK HDR 6POS 90DEG 3.81MM; Manufacturer: Amphenol Anytek; Current - UL: 10A; Header Orientation: 90°, Right Angle; Number of Levels: 1; Number of Positions: 6; Pitch: 0.150" (3.81mm); Voltage - UL: 300V; Part Number: OQ0632510000G; Color: Green; ComponentLink1Description: Datasheet; ComponentLink1URL: http://portal.fciconnect.com/Comergent//fci/drawing/oqxx32x100j0g.pdf; ComponentLink2Description: DigiKey Link; ComponentLink2URL: //digikey.com/product-detail/en/amphenol-anytek/OQ0632510000G/609-3823-ND/2261282; Contact Mating Finish: Tin; LastUpdated: 16-12-2019 7.16.11 PM; Lifecycle Status: 0; Minimum Order: 1; Mounting Type: Through Hole; Operating Temperature: -40°C ~ 115°C; Packaging: Bulk; Part Status: Active; Positions Per Level: 6; Price: 0.80; Series: 06-381; Supplier 1: DigiKey; Supplier Part Number 1: 609-3823-ND; Termination Style: Solder; Type: Header, Male Pins, Shrouded (4 Side)
PS1 = RK-0505S/H: DC/DC Converter, 1 Watt, SIP7, Single Output; MF: {'manufacturer': u'Recom Power'}; Package: None; Price: None; Value: *; MP: RK-0505S/H; Availability: Unavailable
Q1-Q3 = BC847BLT1G: TRANS NPN 45V 0.1A SOT23; Manufacturer: ON Semiconductor; Current - Collector Cutoff (Max): 15nA (ICBO); Current - Collector (Ic) (Max): 100mA; DC Current Gain (hFE) (Min) @ Ic, Vce: 200 @ 2mA, 5V; Frequency - Transition: 100MHz; Power - Max: 300mW; Vce Saturation (Max) @ Ib, Ic: 600mV @ 5mA, 100mA; Part Number: BC847BLT1G; ComponentLink1Description: Datasheet; ComponentLink1URL: http://www.onsemi.com/pub/Collateral/BC846ALT1-D.PDF; ComponentLink2Description: DigiKey Link; ComponentLink2URL: http://digikey.com/product-detail/en/on-semiconductor/BC847BLT1G/BC847BLT1GOSCT-ND/917834; LastUpdated: 29-03-2026 8.43.49 PM; Lifecycle Status: Active; Minimum Order: 1; Mounting Type: Surface Mount; Operating Temperature: -55°C ~ 150°C (TJ); Package / Case: TO-236-3, SC-59, SOT-23-3; Packaging: TapeAndReel; PartId: 246; Part Status: Active; Price: 0.02; Series: -; Supplier 1: DigiKey; Supplier Part Number 1: BC847BLT1GOSCT-ND; Supplier Device Package: SOT-23-3 (TO-236); Transistor Type: NPN; Voltage - Collector Emitter Breakdown (Max): 45V
R36 R39 R44 R47 R52 R55 R60 R61 R67 R71 R74 R79 = ESR10EZPF1002: RES SMD 10K OHM 1% 0.4W 0805; Manufacturer: Rohm Semiconductor; Power (Watts): 0.4W, 2/5W; Temperature Coefficient: ±100ppm/°C; Part Number: ESR10EZPF1002; Value: 10 kOhms; ComponentLink1Description: Datasheet; ComponentLink1URL: https://www.rohm.com/datasheet/ESR01MZPF/esr-e; ComponentLink2Description: DigiKey Link; ComponentLink2URL: https://www.digikey.com/en/products/detail/rohm-semiconductor/ESR10EZPF1002/1983481; Composition: Thick Film; Device Package: 0805 (2012 Metric); Features: Automotive AEC-Q200, Pulse Withstanding; Height - Seated (Max): 0.026" (0.65mm); LastUpdated: 08-02-2024 9.02.37 PM; Lifecycle Status: Active; Minimum Order: 1; Number of Terminations: 2; Operating Temperature: -55°C ~ 155°C; Package / Case: 0805 (2012 Metric); Packaging: TapeAndReel; PartId: 28034; Part Status: Active; Price: 0.02; Ratings: AEC-Q200; Resistance: 10 kOhms; Series: ESR; Size / Dimension: 0.079" L x 0.049" W (2.00mm x 1.25mm); Supplier 1: DigiKey; Supplier Part Number 1: RHM10.0KAECT-ND; Supplier Device Package: 0805; Tolerance: ±1%
R37 R40 R45 R48 R53 R57 R62 R63 R69 R72 R76 R80 = ESR10EZPF1001: RES SMD 1K OHM 1% 0.4W 0805; Manufacturer: Rohm Semiconductor; Power (Watts): 0.4W, 2/5W; Temperature Coefficient: ±100ppm/°C; Part Number: ESR10EZPF1001; Value: 1 kOhms; ComponentLink1Description: Datasheet; ComponentLink1URL: https://www.rohm.com/datasheet/ESR01MZPF/esr-e; ComponentLink2Description: DigiKey Link; ComponentLink2URL: https://www.digikey.com/en/products/detail/rohm-semiconductor/ESR10EZPF1001/1983480; Composition: Thick Film; Device Package: 0805 (2012 Metric); Features: Automotive AEC-Q200, Pulse Withstanding; Height - Seated (Max): 0.026" (0.65mm); LastUpdated: 08-02-2024 9.02.37 PM; Lifecycle Status: Active; Minimum Order: 1; Number of Terminations: 2; Operating Temperature: -55°C ~ 155°C; Package / Case: 0805 (2012 Metric); Packaging: TapeAndReel; PartId: 28032; Part Status: Active; Price: 0.02; Ratings: AEC-Q200; Resistance: 1 kOhms; Series: ESR; Size / Dimension: 0.079" L x 0.049" W (2.00mm x 1.25mm); Supplier 1: DigiKey; Supplier Part Number 1: RHM1.00KAECT-ND; Supplier Device Package: 0805; Tolerance: ±1%
R41 R42 R49 R50 R56 R58 R64 R65 R68 R70 R75 R77 R78 R81 R82 = CRCW0805330RFKEAHP: RES SMD 330 OHM 1% 1/2W 0805; Manufacturer: Vishay Dale; Power (Watts): 0.5W, 1/2W; Temperature Coefficient: ±100ppm/°C; Part Number: CRCW0805330RFKEAHP; Value: 330 Ohms; ComponentLink1Description: Datasheet; ComponentLink1URL: http://www.vishay.com/docs/20043/crcwhpe3.pdf; ComponentLink2Description: DigiKey Link; ComponentLink2URL: https://www.digikey.com/en/products/detail/vishay-dale/CRCW0805330RFKEAHP/2226912; Composition: Thick Film; Device Package: 0805 (2012 Metric); Features: Automotive AEC-Q200, Pulse Withstanding; Height - Seated (Max): 0.020" (0.50mm); LastUpdated: 08-02-2024 9.02.28 PM; Lifecycle Status: Active; Minimum Order: 1; Number of Terminations: 2; Operating Temperature: -55°C ~ 155°C; Package / Case: 0805 (2012 Metric); Packaging: TapeAndReel; PartId: 30364; Part Status: Active; Price: 0.02; Ratings: AEC-Q200; Resistance: 330 Ohms; Series: CRCW-HP; Size / Dimension: 0.079" L x 0.049" W (2.00mm x 1.25mm); Supplier 1: DigiKey; Supplier Part Number 1: 541-330TCT-ND; Supplier Device Package: 0805; Tolerance: ±1%

## Sheet Relay.SchDoc
size A4; SheetNumber: 6; SheetTotal: 8
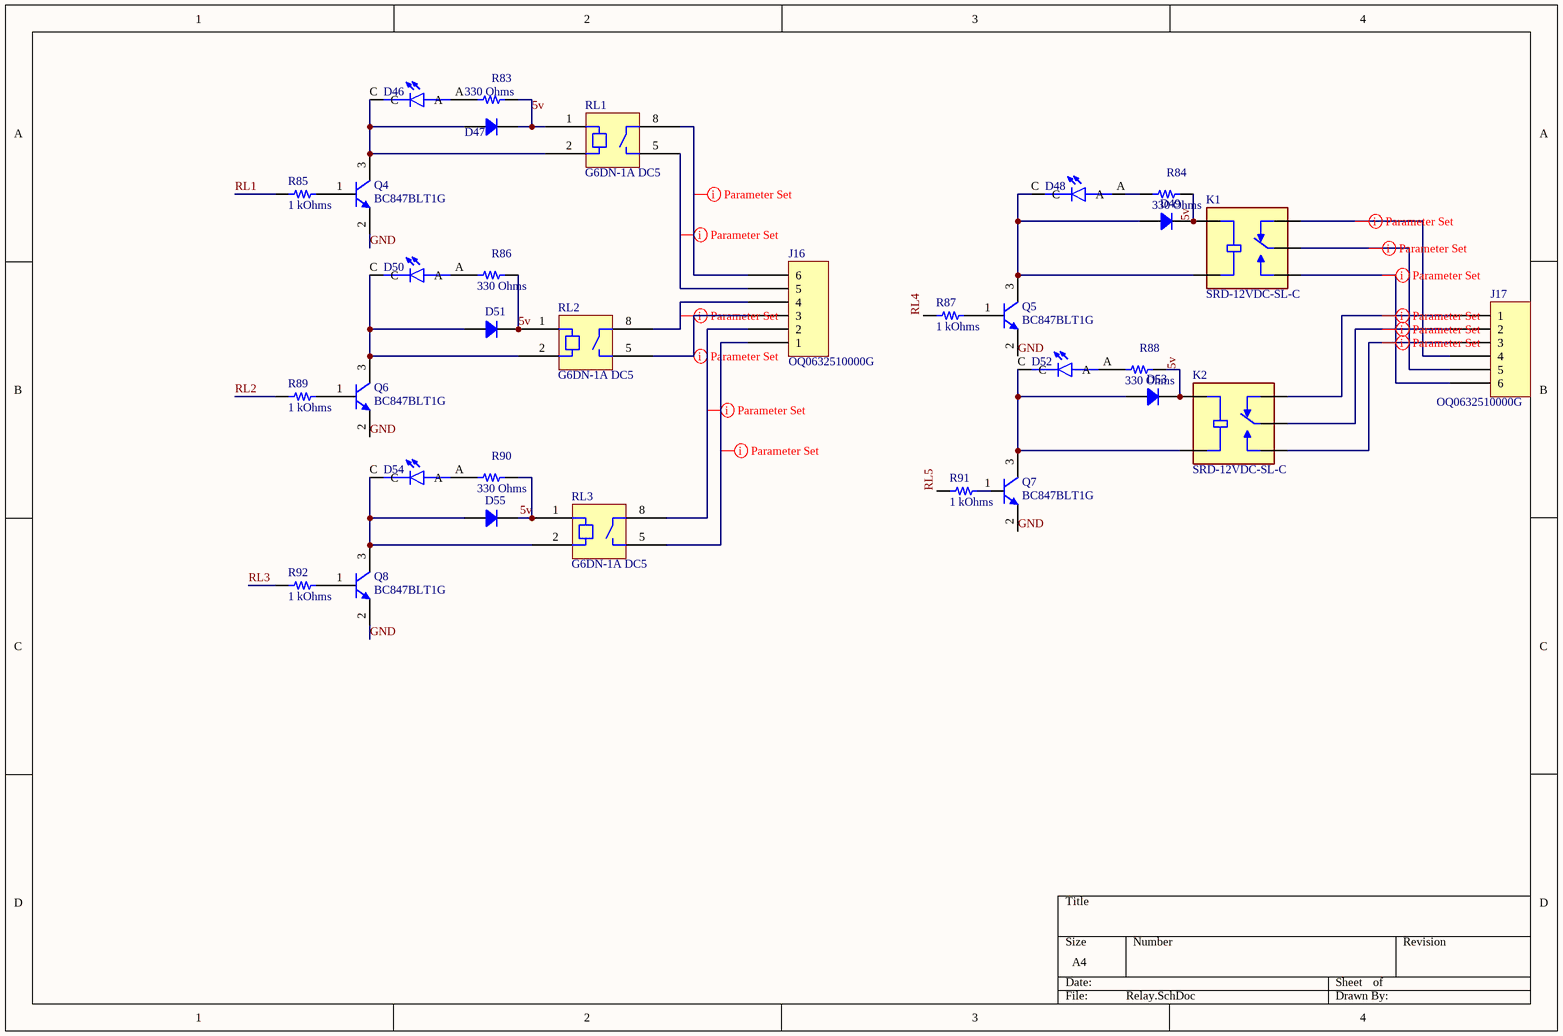
[diagram p5: Relay.SchDoc]

### Parts
D46  597-3305-607F  [LEDC2012X70N]  (value not drawn)
D47  CGRA4007-G  [DO214AC SMA]  (value not drawn)
D48  597-3305-607F  [LEDC2012X70N]  (value not drawn)
D49  CGRA4007-G  [DO214AC SMA]  (value not drawn)
D50  597-3305-607F  [LEDC2012X70N]  (value not drawn)
D51  CGRA4007-G  [DO214AC SMA]  (value not drawn)
D52  597-3305-607F  [LEDC2012X70N]  (value not drawn)
D53  CGRA4007-G  [DO214AC SMA]  (value not drawn)
D54  597-3305-607F  [LEDC2012X70N]  (value not drawn)
D55  CGRA4007-G  [DO214AC SMA]  (value not drawn)
J16  OQ0632510000G  [FCI 06-381-6PIN]
J17  OQ0632510000G  [FCI 06-381-6PIN]
K1  SRD-12VDC-SL-C  [RELAY_SRD-12VDC-SL-C]
K2  SRD-12VDC-SL-C  [RELAY_SRD-12VDC-SL-C]
Q4  BC847BLT1G  [ON SEMI SOT-23-3]
Q5  BC847BLT1G  [ON SEMI SOT-23-3]
Q6  BC847BLT1G  [ON SEMI SOT-23-3]
Q7  BC847BLT1G  [ON SEMI SOT-23-3]
Q8  BC847BLT1G  [ON SEMI SOT-23-3]
R83  330 Ohms  [RES 0805_2012]
R84  330 Ohms  [RES 0805_2012]
R85  1 kOhms  [RES 0805_2012]
R86  330 Ohms  [RES 0805_2012]
R87  1 kOhms  [RES 0805_2012]
R88  330 Ohms  [RES 0805_2012]
R89  1 kOhms  [RES 0805_2012]
R90  330 Ohms  [RES 0805_2012]
R91  1 kOhms  [RES 0805_2012]
R92  1 kOhms  [RES 0805_2012]
RL1  G6DN-1A DC5  [OMRON G6DN]
RL2  G6DN-1A DC5  [OMRON G6DN]
RL3  G6DN-1A DC5  [OMRON G6DN]

### Nets
5v: D47.2 D49.2 D51.2 D53.2 D55.2 K1.COIL1 K2.COIL1 R83.2 R84.2 R86.2 R88.2 R90.2 RL1.1(COIL1) RL2.1(COIL1) RL3.1(COIL1)
GND: Q4.2(E) Q5.2(E) Q6.2(E) Q7.2(E) Q8.2(E)
RL1: R85.1
RL2: R89.1
RL3: R92.1
RL4: R87.1
RL5: R91.1
NetD46_A: D46.A R83.1
NetD46_C: D46.C D47.1 Q4.3(C) RL1.2(COIL2)
NetD48_A: D48.A R84.1
NetD48_C: D48.C D49.1 K1.COIL2 Q5.3(C)
NetD50_A: D50.A R86.1
NetD50_C: D50.C D51.1 Q6.3(C) RL2.2(COIL2)
NetD52_A: D52.A R88.1
NetD52_C: D52.C D53.1 K2.COIL2 Q7.3(C)
NetD54_A: D54.A R90.1
NetD54_C: D54.C D55.1 Q8.3(C) RL3.2(COIL2)
NetJ16_1: J16.1 RL3.5(TERM1)
NetJ16_2: J16.2 RL3.8(TERM2)
NetJ16_3: J16.3 RL2.5(TERM1)
NetJ16_4: J16.4 RL2.8(TERM2)
NetJ16_5: J16.5 RL1.5(TERM1)
NetJ16_6: J16.6 RL1.8(TERM2)
NetJ17_1: J17.1 K2.NC
NetJ17_2: J17.2 K2.COM
NetJ17_3: J17.3 K2.NO
NetJ17_4: J17.4 K1.NC
NetJ17_5: J17.5 K1.COM
NetJ17_6: J17.6 K1.NO
NetQ4_1: Q4.1(B) R85.2
NetQ5_1: Q5.1(B) R87.2
NetQ6_1: Q6.1(B) R89.2
NetQ7_1: Q7.1(B) R91.2
NetQ8_1: Q8.1(B) R92.2

### Layout directives
net class High_current: NetJ16_1, NetJ16_2, NetJ16_3, NetJ16_4, NetJ16_5, NetJ16_6, NetJ17_1, NetJ17_2, NetJ17_3, NetJ17_4, NetJ17_5, NetJ17_6

### Library data of the parts
D46 D48 D50 D52 D54 = 597-3305-607F: LED Uni-Color Green 4-Pin Chip 0805 T/R; Availability: Unavailable; Value: *; Price: None; MP: 597-3305-607F; Package: None
D47 D49 D51 D53 D55 = CGRA4007-G: DIODE GEN PURP 1KV 1A DO214AC; Manufacturer: Comchip Technology; Current - Reverse Leakage @ Vr: 5 µA @ 1000 V; Diode Type: Standard; Speed: Standard Recovery >500ns, > 200mA (Io); Voltage - DC Reverse (Vr) (Max): 1000 V; Voltage - Forward (Vf) (Max) @ If: 1.1 V @ 1 A; Part Number: CGRA4007-G; ComponentLink1Description: Datasheet; ComponentLink1URL: http://www.comchiptech.com/admin/files/product/CGRA4001-G Thru647907. CGRA4007-G RevE.pdf; ComponentLink2Description: DigiKey Link; ComponentLink2URL: https://www.digikey.com/en/products/detail/comchip-technology/CGRA4007-G/1121050; Current - Average Rectified (Io): 1A; LastUpdated: 03-06-2024 7.54.36 PM; Lifecycle Status: Active; Minimum Order: 1; Mounting Type: Surface Mount; Operating Temperature - Junction: -55°C ~ 150°C; Package / Case: DO-214AC, SMA; Packaging: TapeAndReel; PartId: 670; Part Status: Active; Price: 0.04; Series: -; Supplier 1: DigiKey; Supplier Part Number 1: 641-1018-1-ND; Supplier Device Package: DO-214AC (SMA)
J16 J17 = OQ0632510000G: as J2 on sheet DI_DO; Part Number: OQ0632510000G; Color: Green; ComponentLink1Description: Datasheet; ComponentLink1URL: http://portal.fciconnect.com/Comergent//fci/drawing/oqxx32x100j0g.pdf; ComponentLink2Description: DigiKey Link; ComponentLink2URL: //digikey.com/product-detail/en/amphenol-anytek/OQ0632510000G/609-3823-ND/2261282; Contact Mating Finish: Tin; LastUpdated: 16-12-2019 7.16.11 PM; Lifecycle Status: 0; Minimum Order: 1; Mounting Type: Through Hole; Operating Temperature: -40°C ~ 115°C; Packaging: Bulk; Part Status: Active; Positions Per Level: 6; Price: 0.80; Series: 06-381; Supplier 1: DigiKey; Supplier Part Number 1: 609-3823-ND; Termination Style: Solder; Type: Header, Male Pins, Shrouded (4 Side)
K1 K2 = SRD-12VDC-SL-C: General Purpose Non Latching 12VDC SPDT Through Hole Relays RoHS; MF: Songle Relay; SnapEDA_Link: https://www.snapeda.com/parts/SRD-12VDC-SL-C/Songle+Relay/view-part/?ref=snap; Package: NON STANDARD-5 Songle Relay; Value: *; MP: SRD-12VDC-SL-C; Check_prices: https://www.snapeda.com/parts/SRD-12VDC-SL-C/Songle+Relay/view-part/?ref=eda
Q4-Q8 = BC847BLT1G: as Q1 on sheet DI_DO; Part Number: BC847BLT1G; ComponentLink1Description: Datasheet; ComponentLink1URL: http://www.onsemi.com/pub/Collateral/BC846ALT1-D.PDF; ComponentLink2Description: DigiKey Link; ComponentLink2URL: http://digikey.com/product-detail/en/on-semiconductor/BC847BLT1G/BC847BLT1GOSCT-ND/917834; LastUpdated: 29-03-2026 8.43.49 PM; Lifecycle Status: Active; Minimum Order: 1; Mounting Type: Surface Mount; Operating Temperature: -55°C ~ 150°C (TJ); Package / Case: TO-236-3, SC-59, SOT-23-3; Packaging: TapeAndReel; PartId: 246; Part Status: Active; Price: 0.02; Series: -; Supplier 1: DigiKey; Supplier Part Number 1: BC847BLT1GOSCT-ND; Supplier Device Package: SOT-23-3 (TO-236); Transistor Type: NPN; Voltage - Collector Emitter Breakdown (Max): 45V
R83 R84 R86 R88 R90 = CRCW0805330RFKEAHP: as R41 on sheet DI_DO; Part Number: CRCW0805330RFKEAHP; Value: 330 Ohms; ComponentLink1Description: Datasheet; ComponentLink1URL: http://www.vishay.com/docs/20043/crcwhpe3.pdf; ComponentLink2Description: DigiKey Link; ComponentLink2URL: https://www.digikey.com/en/products/detail/vishay-dale/CRCW0805330RFKEAHP/2226912; Composition: Thick Film; Device Package: 0805 (2012 Metric); Features: Automotive AEC-Q200, Pulse Withstanding; Height - Seated (Max): 0.020" (0.50mm); LastUpdated: 08-02-2024 9.02.28 PM; Lifecycle Status: Active; Minimum Order: 1; Number of Terminations: 2; Operating Temperature: -55°C ~ 155°C; Package / Case: 0805 (2012 Metric); Packaging: TapeAndReel; PartId: 30364; Part Status: Active; Price: 0.02; Ratings: AEC-Q200; Resistance: 330 Ohms; Series: CRCW-HP; Size / Dimension: 0.079" L x 0.049" W (2.00mm x 1.25mm); Supplier 1: DigiKey; Supplier Part Number 1: 541-330TCT-ND; Supplier Device Package: 0805; Tolerance: ±1%
R85 R87 R89 R91 R92 = ESR10EZPF1001: as R37 on sheet DI_DO; Part Number: ESR10EZPF1001; Value: 1 kOhms; ComponentLink1Description: Datasheet; ComponentLink1URL: https://www.rohm.com/datasheet/ESR01MZPF/esr-e; ComponentLink2Description: DigiKey Link; ComponentLink2URL: https://www.digikey.com/en/products/detail/rohm-semiconductor/ESR10EZPF1001/1983480; Composition: Thick Film; Device Package: 0805 (2012 Metric); Features: Automotive AEC-Q200, Pulse Withstanding; Height - Seated (Max): 0.026" (0.65mm); LastUpdated: 08-02-2024 9.02.37 PM; Lifecycle Status: Active; Minimum Order: 1; Number of Terminations: 2; Operating Temperature: -55°C ~ 155°C; Package / Case: 0805 (2012 Metric); Packaging: TapeAndReel; PartId: 28032; Part Status: Active; Price: 0.02; Ratings: AEC-Q200; Resistance: 1 kOhms; Series: ESR; Size / Dimension: 0.079" L x 0.049" W (2.00mm x 1.25mm); Supplier 1: DigiKey; Supplier Part Number 1: RHM1.00KAECT-ND; Supplier Device Package: 0805; Tolerance: ±1%
RL1-RL3 = G6DN-1A DC5: RELAY GEN PURPOSE SPST 5A 5V; Manufacturer: Omron Electronics Inc-EMC Div; Coil Current: 22 mA; Coil Insulation: Class B; Coil Type: Non Latching; Coil Voltage: 5VDC; Contact Form: SPST-NO (1 Form A); Must Operate Voltage: 3.5 VDC; Must Release Voltage: 0.25 VDC; Operate Time: 10 ms; Relay Type: General Purpose; Release Time: 5 ms; Seal Rating: Sealed - Fully; Switching Voltage: 277VAC, 125VDC - Max; Part Number: G6DN-1A DC5; ComponentLink1Description: Datasheet; ComponentLink1URL: https://omronfs.omron.com/en_US/ecb/products/pdf/en-g6dn.pdf; ComponentLink2Description: DigiKey Link; ComponentLink2URL: https://www.digikey.com/en/products/detail/omron-electronics-inc-emc-div/G6DN-1A-DC5/5864613; Contact Material: Silver Alloy; Contact Rating (Current): 5 A; LastUpdated: 16-08-2023 4.45.25 PM; Lifecycle Status: Active; Minimum Order: 1; Mounting Type: Through Hole; Operating Temperature: -40°C ~ 90°C; Packaging: Tube; Part Status: Active; Price: 1.26; Series: G6DN; Supplier 1: DigiKey; Supplier Part Number 1: Z5439-ND; Termination Style: PC Pin